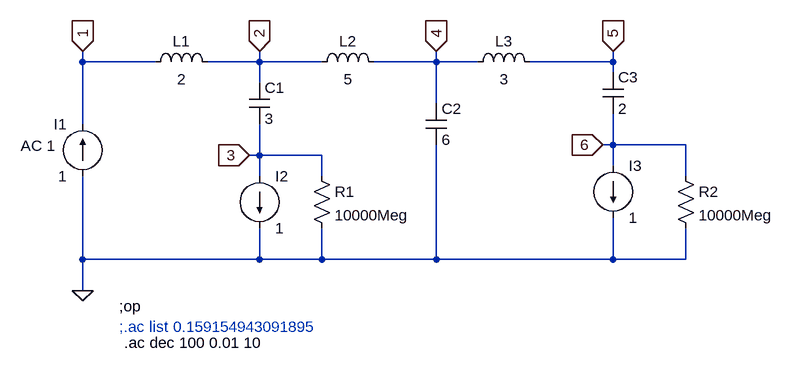
[diagram p0: schematic test_12.asc]
test_12.asc, the LTspice schematic file:
Version 4
SHEET 1 880 680
WIRE -400 -208 -400 -224
WIRE -288 -208 -400 -208
WIRE -128 -208 -128 -224
WIRE -128 -208 -208 -208
WIRE -32 -208 -128 -208
WIRE 144 -208 144 -224
WIRE 144 -208 48 -208
WIRE 208 -208 144 -208
WIRE 416 -208 416 -224
WIRE 416 -208 288 -208
WIRE 416 -192 416 -208
WIRE -128 -176 -128 -208
WIRE 144 -144 144 -208
WIRE -400 -112 -400 -208
WIRE 416 -80 416 -128
WIRE 416 -80 400 -80
WIRE 528 -80 416 -80
WIRE -128 -64 -128 -112
WIRE -128 -64 -144 -64
WIRE -32 -64 -128 -64
WIRE 416 -48 416 -80
WIRE -128 -32 -128 -64
WIRE -32 -32 -32 -64
WIRE 528 -32 528 -80
WIRE -400 96 -400 -32
WIRE -128 96 -128 48
WIRE -128 96 -400 96
WIRE -32 96 -32 48
WIRE -32 96 -128 96
WIRE 144 96 144 -80
WIRE 144 96 -32 96
WIRE 416 96 416 32
WIRE 416 96 144 96
WIRE 528 96 528 48
WIRE 528 96 416 96
WIRE -400 144 -400 96
FLAG -400 144 0
FLAG -400 -224 1
IOPIN -400 -224 In
FLAG -128 -224 2
IOPIN -128 -224 In
FLAG 144 -224 4
IOPIN 144 -224 In
FLAG 416 -224 5
IOPIN 416 -224 In
FLAG 400 -80 6
IOPIN 400 -80 In
FLAG -144 -64 3
IOPIN -144 -64 In
SYMBOL cap -144 -176 R0
SYMATTR InstName C1
SYMATTR Value 3
SYMBOL current -400 -32 R180
WINDOW 0 24 80 Left 2
WINDOW 3 24 0 Left 2
WINDOW 123 42 47 Left 2
WINDOW 39 0 0 Left 0
SYMATTR InstName I1
SYMATTR Value 1
SYMATTR Value2 AC 1
SYMBOL current -128 -32 R0
WINDOW 123 0 0 Left 0
WINDOW 39 0 0 Left 0
SYMATTR InstName I2
SYMATTR Value 1
SYMBOL current 416 -48 R0
WINDOW 123 0 0 Left 0
WINDOW 39 0 0 Left 0
SYMATTR InstName I3
SYMATTR Value 1
SYMBOL cap 128 -144 R0
SYMATTR InstName C2
SYMATTR Value 6
SYMBOL cap 400 -192 R0
SYMATTR InstName C3
SYMATTR Value 2
SYMATTR SpiceLine Rser=0
SYMBOL ind -304 -192 R270
WINDOW 0 32 56 VTop 2
WINDOW 3 5 56 VBottom 2
SYMATTR InstName L1
SYMATTR Value 2
SYMATTR SpiceLine Rser=0
SYMBOL ind -48 -192 R270
WINDOW 0 32 56 VTop 2
WINDOW 3 5 56 VBottom 2
SYMATTR InstName L2
SYMATTR Value 5
SYMATTR SpiceLine Rser=0
SYMBOL ind 192 -192 R270
WINDOW 0 32 56 VTop 2
WINDOW 3 5 56 VBottom 2
SYMATTR InstName L3
SYMATTR Value 3
SYMBOL res -48 -48 R0
SYMATTR InstName R1
SYMATTR Value 10000Meg
SYMBOL res 512 -48 R0
SYMATTR InstName R2
SYMATTR Value 10000Meg
TEXT -344 168 Left 2 !;op
TEXT -344 200 Left 2 ;;.ac list 0.159154943091895
TEXT -336 224 Left 2 !.ac dec 100 0.01 10

The netlist it stands for:
* test_12.asc
C1 2 3 3
I1 0 1 1 AC 1
I2 3 0 1
I3 6 0 1
C2 4 0 6
C3 5 6 2 Rser=0
L1 1 2 2 Rser=0
L2 2 4 5 Rser=0
L3 4 5 3
R1 3 0 10000Meg
R2 6 0 10000Meg
;op
* ;.ac list 0.159154943091895
.ac dec 100 0.01 10
.backanno
.end